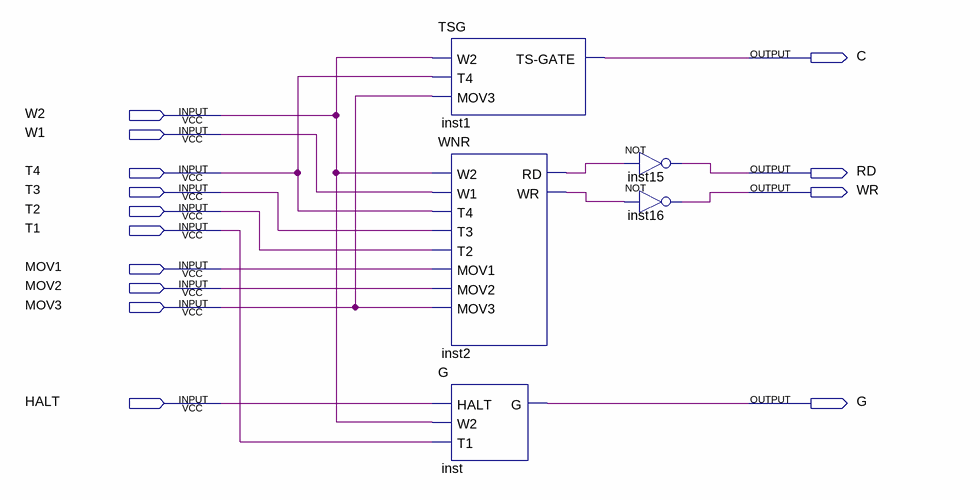
[diagram p0: schematic sheet]
// Quartus schematic SIGNAL.bdf as structural Verilog: 5 symbols, 14 pins
module SIGNAL (
  input  W2,
  input  W1,
  input  T4,
  input  T3,
  input  T2,
  input  T1,
  input  MOV1,
  input  MOV2,
  input  MOV3,
  input  HALT,
  output C,
  output RD,
  output WR,
  output G
);

  wire inst2_rd, inst2_wr;

  TSG inst1 (.W2(W2), .T4(T4), .MOV3(MOV3), .\TS-GATE (C));
  WNR inst2 (
    .W2(W2), .W1(W1), .T4(T4), .T3(T3), .T2(T2), .MOV1(MOV1), .MOV2(MOV2), .MOV3(MOV3), .RD(inst2_rd),
    .WR(inst2_wr));
  G inst (.HALT(HALT), .W2(W2), .T1(T1), .G(G));
  not inst15 (RD, inst2_rd);
  not inst16 (WR, inst2_wr);
endmodule
